# Altium schematic sheet 10_CAN_BUS.SchDoc
size A4
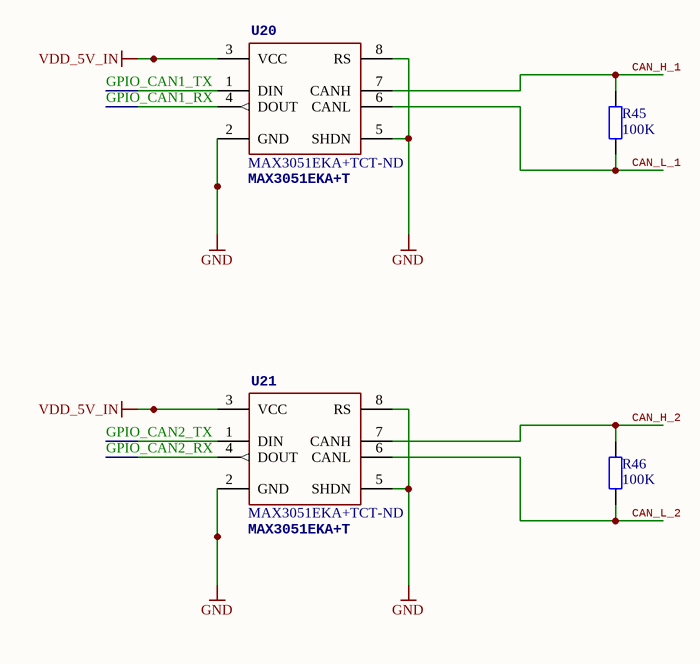
[diagram p0: 10_CAN_BUS.SchDoc]

## Parts
R45  100K  [R0402]
R46  100K  [R0402]
U20  MAX3051EKA+T  Supplier Part Number 1: MAX3051EKA+TCT-ND  [SOT23-8]
U21  MAX3051EKA+T  Supplier Part Number 1: MAX3051EKA+TCT-ND  [SOT23-8]

## Nets
GND: U20.2(GND) U20.5(SHDN) U20.8(RS) U21.2(GND) U21.5(SHDN) U21.8(RS)
VDD_5V_IN: U20.3(VCC) U21.3(VCC)
CAN_H_1: R45.1 U20.7(CANH)
CAN_H_2: R46.1 U21.7(CANH)
CAN_L_1: R45.2 U20.6(CANL)
CAN_L_2: R46.2 U21.6(CANL)
GPIO_CAN1_RX: U20.4(DOUT)
GPIO_CAN1_TX: U20.1(DIN)
GPIO_CAN2_RX: U21.4(DOUT)
GPIO_CAN2_TX: U21.1(DIN)

## Library data of the parts
R45 R46 = Res2: Resistor; Value: 1K; Published: 8-Jun-2000; LatestRevisionDate: 17-Jul-2002; LatestRevisionNote: Re-released for DXP Platform.; PackageReference: AXIAL-0.4; Publisher: Altium Limited; PackageDescription: Axial Device, Thru-Hole; 2 Leads; 0.4 in Pin Spacing
U20 U21 = MAX3051MAX3051EKA: IC TXRX CAN 1MBPS SOT23-8; 3DR_PARTNO: ECM0831; Supplier 1: Digi-Key; PARTNO: MAX3051EKA+T; Value: CAN